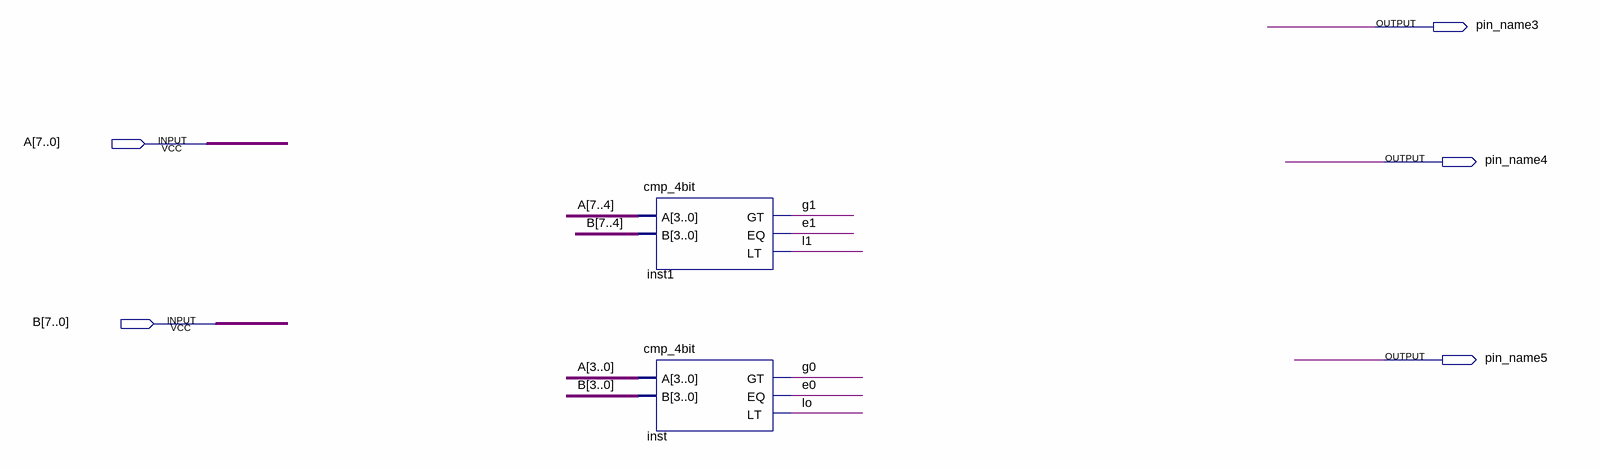
[diagram p0: schematic sheet]
// Quartus schematic cmp_8bit_test.bdf as structural Verilog: 2 symbols, 5 pins
module cmp_8bit_test (
  input  [7:0] A,
  input  [7:0] B,
  output pin_name3,
  output pin_name4,
  output pin_name5
);

  wire e0, e1, g0, g1, l1, lo;

  cmp_4bit inst1 (.A(A[7:4]), .B(B[7:4]), .GT(g1), .EQ(e1), .LT(l1));
  cmp_4bit inst (.A(A[3:0]), .B(B[3:0]), .GT(g0), .EQ(e0), .LT(lo));
endmodule
